# EAGLE board RectangularThing-SOICs-TWEAKS-3 (EAGLE 7.7.0), part 1 of 2
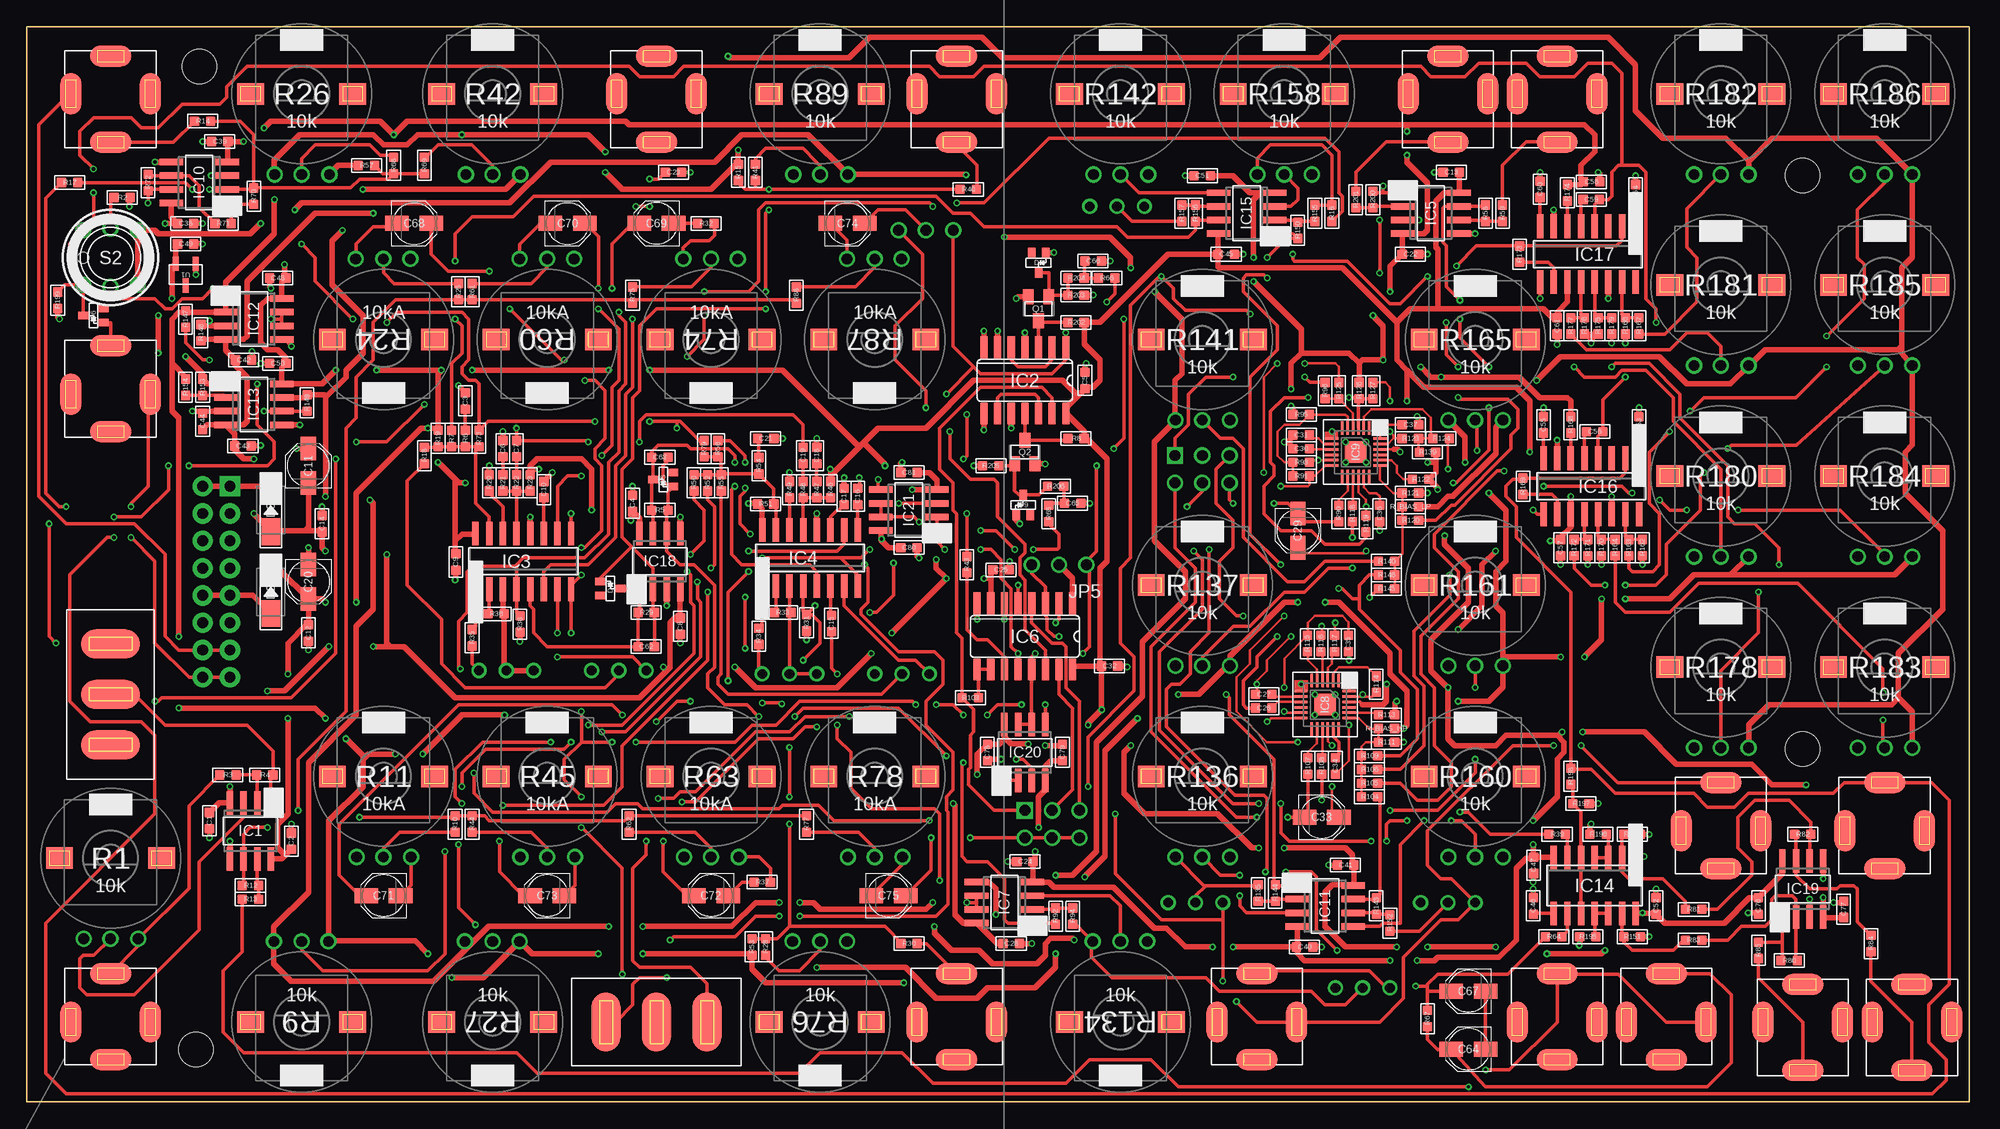
[diagram p13: board, top side]
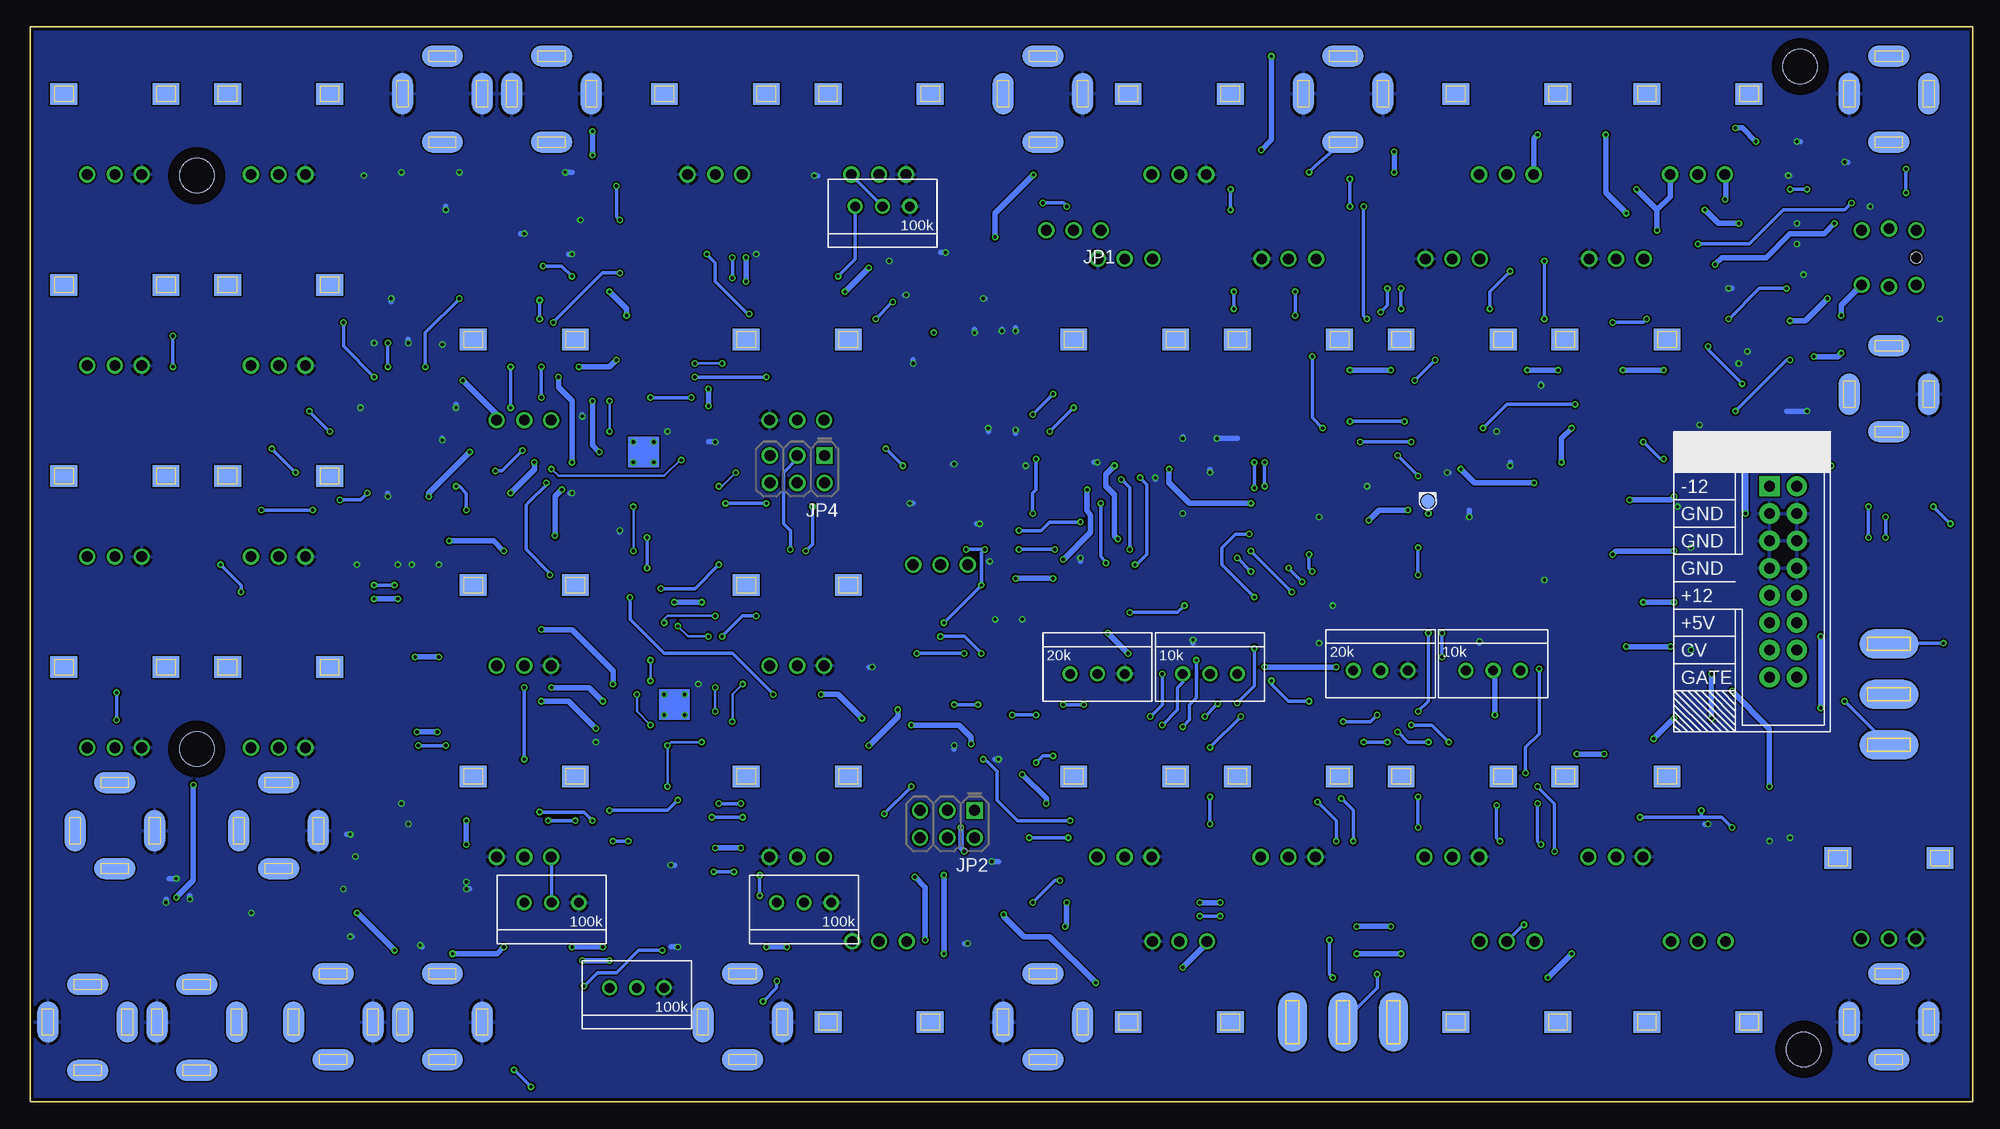
[diagram p14: board, bottom side, seen from below]

Size 180.78 x 100 mm. Coordinates in mm from the lower left corner, seen from the top.
Copper layers (1*16): Top 0.035mm / dielectric 1.5mm / Bottom 0.035mm
Design rules "ITEADstudio_DRC *": minimum track width 6mil, minimum drill 12mil, track to track 6mil, track to pad 6mil, pad to pad 6mil, via to via 6mil, smd to smd 0mil, copper to edge 10mil, drill to drill 10mil, minimum pad ring 10mil, minimum via ring 6mil, stop-mask expansion 2mil, vias tented up to drill 100mil, thermal gap 10mil
Net classes: 0 default: width 0.305 mm; 1 power: width 0.508 mm; 2 nearfilter: width 0.254 mm; 3 groundplane: width 0.203 mm, clearance 0.203 mm

## Footprints (pad centres in the part's own frame; a part is rotated, then mirrored left to right if it is on the bottom)
C0603 = smd 0.889 x 0.889: 1 -0.762,0; 2 0.762,0
CASE_B = smd 2.2 x 1.4: + 1.6,0; - -1.6,0
DO-214AC = smd 2.5 x 1.7: 1 -2,0; 2 2,0
SOT-323 = smd 0.7 x 0.9: ANODE -0.65,-0.95; CATHODE 0,0.95; NC 0.65,-0.95
3.2-NOMARKINGS-SMALLSAFEZONE = hole 3.2: 0,0
SO08 = smd 0.6 x 2.2: 1 -1.905,-2.6; 2 -0.635,-2.6; 3 0.635,-2.6; 4 1.905,-2.6; 5 1.905,2.6; 6 0.635,2.6; 7 -0.635,2.6; 8 -1.905,2.6
SO14 = smd 0.66 x 2.032: 1 -3.81,-3.073; 2 -2.54,-3.073; 3 -1.27,-3.073; 4 0,-3.073; 5 1.27,-3.073; 6 2.54,-3.073; 7 3.81,-3.073; 8 3.81,3.073; 9 2.54,3.073; 10 1.27,3.073; 11 0,3.073; 12 -1.27,3.073; 13 -2.54,3.073; 14 -3.81,3.073
SO16 = smd 0.6 x 2.2: 1 -4.445,-2.6; 2 -3.175,-2.6; 3 -1.905,-2.6; 4 -0.635,-2.6; 5 0.635,-2.6; 6 1.905,-2.6; 7 3.175,-2.6; 8 4.445,-2.6; 9 4.445,2.6; 10 3.175,2.6; 11 1.905,2.6; 12 0.635,2.6; 13 -0.635,2.6; 14 -1.905,2.6; 15 -3.175,2.6; 16 -4.445,2.6
SO16' = smd 0.66 x 2.032: 1 -4.445,-3.073; 2 -3.175,-3.073; 3 -1.905,-3.073; 4 -0.635,-3.073; 5 0.635,-3.073; 6 1.905,-3.073; 7 3.175,-3.073; 8 4.445,-3.073; 9 4.445,3.073; 10 3.175,3.073; 11 1.905,3.073; 12 0.635,3.073; 13 -0.635,3.073; 14 -1.905,3.073; 15 -3.175,3.073; 16 -4.445,3.073
QFN24 = smd 1.25 x 0.23: P$1 -2.25,1.25; P$2 -2.25,0.75; P$3 -2.25,0.25; P$4 -2.25,-0.25; P$5 -2.25,-0.75; P$6 -2.25,-1.25; P$13 2.25,-1.25; P$14 2.25,-0.75; P$15 2.25,-0.25; P$16 2.25,0.25; P$17 2.25,0.75; P$18 2.25,1.25 | smd 0.23 x 1.25: P$7 -1.25,-2.25; P$8 -0.75,-2.25; P$9 -0.25,-2.25; P$10 0.25,-2.25; P$11 0.75,-2.25; P$12 1.25,-2.25; P$19 1.25,2.25; P$20 0.75,2.25; P$21 0.25,2.25; P$22 -0.25,2.25; P$23 -0.75,2.25; P$24 -1.25,2.25 | smd 2 x 2: PAD 0,0
SO14' = smd 0.6 x 2.2: 1 -3.81,-2.6; 2 -2.54,-2.6; 3 -1.27,-2.6; 4 0,-2.6; 5 1.27,-2.6; 6 2.54,-2.6; 7 3.81,-2.6; 8 3.81,2.6; 9 2.54,2.6; 10 1.27,2.6; 11 0,2.6; 12 -1.27,2.6; 13 -2.54,2.6; 14 -3.81,2.6
3.5MM-JACK-SWITCH-13MM-NOHOLES = smd 1.95 x 3.85 bottom: RING_B@1 -3.7,0; SWITCH_B@1 3.7,0 | smd 1.95 x 3.85: RING_T@3 -3.7,0; SWITCH_T@3 3.7,0 | smd 3.85 x 1.95 bottom: SECOND_B@1 0,-3.5; TIP_B@1 0,4.5 | smd 3.85 x 1.95: SECOND_T@3 0,-3.5; TIP_T@3 0,4.5
POWER_16_SHROUDED = drill 1.016 pad 1.88 square: 1 -8.89,-1.27 | drill 1.016 pad 1.88: 2 -8.89,1.27; 3 -6.35,-1.27; 4 -6.35,1.27; 5 -3.81,-1.27; 6 -3.81,1.27; 7 -1.27,-1.27; 8 -1.27,1.27; 9 1.27,-1.27; 10 1.27,1.27; 11 3.81,-1.27; 12 3.81,1.27; 13 6.35,-1.27; 14 6.35,1.27; 15 8.89,-1.27; 16 8.89,1.27
1X03_NO_SILK = drill 1.016: 1 0,0; 2 2.54,0; 3 5.08,0
2X3-NS = drill 1.016 square: 1 -2.54,-1.27 | drill 1.016: 2 -2.54,1.27; 3 0,-1.27; 4 0,1.27; 5 2.54,-1.27; 6 2.54,1.27
SOT23-BEC = smd 1 x 1.4: B -0.95,-1.1; C 0,1.1; E 0.95,-1.1
ALPS_POT_SQUAREHOLES = drill 1: P$1 -2.5,-7.5; P$2 0,-7.5; P$3 2.58,-7.5 | smd 2.5 x 2: P$4 -4.75,0; P$5 4.75,0 | smd 2.5 x 2 bottom: P$6 -4.75,0; P$7 4.75,0
R0603 = smd 0.889 x 0.889: 1 -0.762,0; 2 0.762,0
TRIMPOT = drill 0.9: P$1 -2.54,0; P$2 0,0; P$3 2.54,0
MULTICOMP1MS-ONOFFON_NOHOLES = smd 2.7 x 5.5 bottom: 1_B -4.7,0; 2_B 0,0; 3_B 4.7,0 | smd 2.7 x 5.5: 1_T -4.7,0; 2_T 0,0; 3_T 4.7,0
PB6149L = drill 1: 1 2.54,2.54; 2 2.54,-2.54; 3 -2.54,2.54; 4 -2.54,-2.54; LEDNEG 0,-2.7; LEDPOS 0,2.7 | hole 1: 2.54,0
PAD.03X.05 = smd 1.27 x 1.27: P$1 0,0
SOT95P237X112-3N = smd 1.321 x 0.559: 1 -1.016,0.94; 2 -1.016,-0.94; 3 1.016,0

## Placement (x,y rotation side)
C1  100nF  [C0603]  17,26.15 270 top
C2  100nF  [C0603]  24.62,24.24 270 top
C3  10nF  [C0603]  40.81,65.2 270 top
C4  100nF  [C0603]  56.37,55.67 270 top
C5  100nF  [C0603]  98.47,67.1 90 top
C6  10nF  [C0603]  44.3,60.75 270 top
C7  100nF  [C0603]  45.57,60.75 90 top
C8  100nF  [C0603]  60.81,44.24 90 top
C9  100nF  [C0603]  39.92,50.21 90 top
C10  1nF C0G  [C0603]  48.11,56.94 90 top
C11  10u  [CASE_B]  26.2,59.17 90 top
C12  100nF  [C0603]  26.2,43.61 270 top
C13  100nF  [C0603]  132.57,86.47 0 top
C14  100nF  [C0603]  27.47,53.77 90 top
C15  1nF C0G  [C0603]  74.88,44.5 270 top
C16  1nF C0G  [C0603]  77.32,56.31 270 top
C17  1nF C0G  [C0603]  76.05,56.31 90 top
C18  10nF  [C0603]  73.51,60.12 270 top
C19  100nF  [C0603]  72.24,60.12 90 top
C20  10u  [CASE_B]  26.2,48.37 270 top
C21  10nF  [C0603]  68.75,61.71 180 top
C22  100nF  [C0603]  128.76,78.85 0 top
C23  1nF C0G  [C0603]  60.18,86.47 0 top
C24  100nF  [C0603]  92.88,22.34 180 top
C25  100nF  [C0603]  90.66,49.48 180 top
C26  300pF  [C0603]  115.1,36.62 0 top
C27  300pF  [C0603]  115.1,37.89 180 top
C28  100nF  [C0603]  91.61,14.72 180 top
C29  1uF  [CASE_B]  118.28,53.13 270 top
C30  300pF  [C0603]  118.6,60.75 0 top
C31  300pF  [C0603]  118.6,62.02 0 top
C32  100nF  [C0603]  100.75,40.53 0 top
C33  1uF  [CASE_B]  120.5,26.46 0 top
C34  300pF  [C0603]  121.77,31.23 270 top
C35  300pF  [C0603]  122.98,42.62 90 top
C36  300pF  [C0603]  125.9,54.72 270 top
C37  300pF  [C0603]  128.76,62.98 0 top
C38  100nF  [C0603]  14.77,81.71 180 top
C39  100nF  [C0603]  17.95,89.33 0 top
C40  100nF  [C0603]  118.91,14.4 0 top
C41  100nF  [C0603]  122.72,22.02 0 top
C42  100nF  [C0603]  20.17,69.01 0 top
C43  100nF  [C0603]  20.11,61.01 0 top
C44  100nF  [C0603]  16.36,63.29 90 top
C45  100nF  [C0603]  111.61,78.85 180 top
C46  5nF  [C0603]  140.19,18.21 90 top
C47  100nF  [C0603]  140.22,21.99 270 top
C48  100nF  [C0603]  23.35,76.63 0 top
C49  100nF  [C0603]  14.77,79.8 180 top
C50  100nF  [C0603]  23.35,68.69 0 top
C51  100nF  [C0603]  109.39,86.15 180 top
C52  100nF  [C0603]  151.62,18.21 270 top
C53  39nF  [C0603]  150.03,62.98 270 top
C54  39nF  [C0603]  149.71,84.57 270 top
C55  20nF  [C0603]  141.14,62.98 270 top
C56  10nF  [C0603]  145.9,62.34 180 top
C57  100nF  [C0603]  142.73,51.55 90 top
C58  100nF  [C0603]  145.61,85.58 180 top
C59  20nF  [C0603]  145.58,83.93 180 top
C60  20nF  [C0603]  140.82,84.88 270 top
C61  100nF  [C0603]  142.41,72.18 270 top
C62  10nF  [C0603]  57.64,42.34 0 top
C63  10nF  [C0603]  58.91,59.96 0 top
C64  10u  [CASE_B]  134.15,4.87 180 top
C65  33pF  [C0603]  97.32,55.67 180 top
C66  33pF  [C0603]  99.23,78.22 180 top
C67  10u  [CASE_B]  134.15,10.27 180 top
C68  10u  [CASE_B]  36.05,81.71 0 top
C69  10u  [CASE_B]  58.59,81.71 180 top
C70  10u  [CASE_B]  50.33,81.71 0 top
C71  10u  [CASE_B]  33.19,19.16 180 top
C72  10u  [CASE_B]  63.67,19.16 180 top
C73  10u  [CASE_B]  48.43,19.16 180 top
C74  10u  [CASE_B]  76.37,81.71 0 top
C75  10u  [CASE_B]  80.18,19.16 0 top
C76  100nF  [C0603]  161.14,18.21 90 top
C77  100nF  [C0603]  169.08,17.89 270 top
C78  100nF  [C0603]  89.39,32.5 90 top
C79  100nF  [C0603]  96.37,32.5 270 top
C80  100nF  [C0603]  82.08,51.55 180 top
C81  100nF  [C0603]  82.08,58.53 0 top
D2  1n4004  [DO-214AC]  22.71,47.42 90 top
D3  1n4004  [DO-214AC]  22.71,55.04 90 top
D4  BAS16W  [SOT-323]  54.3,47.74 270 top
D5  BAS16W  [SOT-323]  59.22,57.9 90 top
D6  BAS16W  [SOT-323]  6.2,73.14 90 top
D8  BAS16W  [SOT-323]  94.15,78.06 180 top
D9  BAS16W  [SOT-323]  92.72,55.52 0 top
H1  MOUNT-HOLE  [3.2-NOMARKINGS-SMALLSAFEZONE]  15.73,4.87 0 top
H2  MOUNT-HOLE  [3.2-NOMARKINGS-SMALLSAFEZONE]  16.04,96.31 0 top
H3  MOUNT-HOLE  [3.2-NOMARKINGS-SMALLSAFEZONE]  165.27,32.81 0 top
H4  MOUNT-HOLE  [3.2-NOMARKINGS-SMALLSAFEZONE]  165.27,86.15 0 top
IC1  TL072  [SO08]  20.81,25.19 180 top
IC2  4013D  [SO14]  92.88,67.1 180 top
IC3  CEM3340SOIC16  [SO16]  46.21,50.28 0 top
IC4  CEM3340SOIC16  [SO16]  72.88,50.59 0 top
IC5  TL072  [SO08]  130.66,82.66 270 top
IC6  4053D  [SO16']  92.88,43.29 180 top
IC7  TL072  [SO08]  90.97,18.53 90 top
IC8  CEM3320_UNFOLDEDQFN  [QFN24]  120.82,36.94 270 top
IC9  CEM3320QFN24  [QFN24]  123.68,60.44 270 top
IC10  TL072  [SO08]  16.04,85.52 90 top
IC11  TL072  [SO08]  120.82,18.21 270 top
IC12  TL072  [SO08]  21.12,72.82 270 top
IC13  TL072  [SO08]  21.12,64.88 270 top
IC14  CEM3360SOIC14  [SO14']  145.9,20.11 180 top
IC15  TL072  [SO08]  113.52,82.66 90 top
IC16  CEM3310SOIC16  [SO16]  145.58,57.26 180 top
IC17  CEM3310SOIC16  [SO16]  145.27,78.85 180 top
IC18  TL072  [SO08]  58.91,50.28 0 top
IC19  TL072  [SO08]  165.27,19.8 0 top
IC20  TL072  [SO08]  92.88,32.5 0 top
IC21  TL072  [SO08]  82.08,55.04 90 top
J1  PJ-341  [3.5MM-JACK-SWITCH-13MM-NOHOLES]  7.79,7.41 0 top
J2  PJ-341  [3.5MM-JACK-SWITCH-13MM-NOHOLES]  7.79,65.83 0 top
J3  PJ-341  [3.5MM-JACK-SWITCH-13MM-NOHOLES]  7.79,93.77 180 top
J4  PJ-341  [3.5MM-JACK-SWITCH-13MM-NOHOLES]  58.59,93.77 180 top
J5  PJ-341  [3.5MM-JACK-SWITCH-13MM-NOHOLES]  86.53,7.41 0 top
J6  PJ-341  [3.5MM-JACK-SWITCH-13MM-NOHOLES]  86.53,93.77 180 top
J7  PJ-341  [3.5MM-JACK-SWITCH-13MM-NOHOLES]  142.41,7.41 0 top
J8  PJ-341  [3.5MM-JACK-SWITCH-13MM-NOHOLES]  132.25,93.77 180 top
J9  PJ-341  [3.5MM-JACK-SWITCH-13MM-NOHOLES]  152.57,7.41 0 top
J10  PJ-341  [3.5MM-JACK-SWITCH-13MM-NOHOLES]  175.43,7.41 180 top
J11  PJ-341  [3.5MM-JACK-SWITCH-13MM-NOHOLES]  157.65,25.19 0 top
J12  PJ-341  [3.5MM-JACK-SWITCH-13MM-NOHOLES]  165.27,7.41 180 top
J13  PJ-341  [3.5MM-JACK-SWITCH-13MM-NOHOLES]  172.89,25.19 0 top
J14  POWERSHROUDED  [POWER_16_SHROUDED]  17.63,48.37 270 bottom
J15  PJ-341  [3.5MM-JACK-SWITCH-13MM-NOHOLES]  114.47,7.41 0 top
J16  PJ-341  [3.5MM-JACK-SWITCH-13MM-NOHOLES]  142.41,93.77 180 top
JP1  1x3pin header  [1X03_NO_SILK]  81.13,81.07 180 bottom
JP2  2x3pin header  [2X3-NS]  95.42,25.83 180 bottom
JP4  2x3pin header  [2X3-NS]  109.39,58.85 180 bottom
JP5  1x3pin header  [1X03_NO_SILK]  98.59,49.96 180 top
PCB1  EURORACK_PCB36HP_10CM  [EURORACK36HP]  -0.34,-3 0 top
Q1  MMBT3904  [SOT23-BEC]  94.15,73.77 180 top
Q2  MMBT3904  [SOT23-BEC]  92.88,60.44 0 top
R1  10k  [ALPS_POT_SQUAREHOLES]  7.79,22.65 0 top
R2  1k  [R0603]  8.87,84.12 0 top
R3  100k  [R0603]  18.71,30.4 0 top
R4  100k  [R0603]  22.14,30.4 0 top
R5  100k  [R0603]  58.91,55.04 0 top
R6  470  [R0603]  40.81,61.71 90 top
R7  100k  [R0603]  39.54,61.71 270 top
R8  68k  [R0603]  97.64,61.71 0 top
R9  10k  [ALPS_POT_SQUAREHOLES]  25.57,7.41 180 top
R10  100k  [R0603]  39.86,25.83 90 top
R11  10kA  [ALPS_POT_SQUAREHOLES]  33.19,30.27 0 top
R12  100k  [R0603]  20.81,20.11 0 top
R13  100  [R0603]  20.81,18.84 180 top
R14  100k  [R0603]  16.36,91.23 0 top
R15  100k  [R0603]  66.21,86.47 90 top
R16  100  [R0603]  121.45,82.66 90 top
R17  100k  [R0603]  3.98,85.52 0 top
R18  1M  [R0603]  37,60.12 270 top
R19  360k  [R0603]  38.27,61.71 270 top
R20  1.8k  [R0603]  43.03,57.58 270 top
R21  470  [R0603]  44.3,57.58 90 top
R22  1M  [R0603]  45.57,57.58 270 top
R23  1.5M  [R0603]  46.84,57.58 270 top
R24  10kA  [ALPS_POT_SQUAREHOLES]  33.19,70.91 180 top
R25  100k  [R0603]  40.17,75.36 270 top
R26  10k  [ALPS_POT_SQUAREHOLES]  25.57,93.77 0 top
R27  10k  [ALPS_POT_SQUAREHOLES]  43.35,7.41 180 top
R28  200k  [R0603]  68.75,14.4 270 top
R29  100k  [R0603]  57.64,45.51 180 top
R30  100k  [R0603]  82.08,14.72 180 top
R31  51k  [R0603]  72.56,44.56 270 top
R32  51k  [R0603]  63.19,81.71 0 top
R33  5.6k  [R0603]  70.34,45.51 0 top
R34  24k  [R0603]  68.11,43.29 270 top
R35  24k  [R0603]  41.44,43.16 270 top
R36  5.6k  [R0603]  43.67,45.39 0 top
R37  51k  [R0603]  68.43,20.43 0 top
R38  51k  [R0603]  45.89,44.43 270 top
R39  47k  [R0603]  142.41,24.88 0 top
R40  100k  [R0603]  87.61,84.88 180 top
R41  200k  [R0603]  67.8,86.47 90 top
R42  10k  [ALPS_POT_SQUAREHOLES]  43.35,93.77 0 top
R43  100k  [R0603]  87.48,49.96 90 top
R44  51k  [R0603]  41.44,25.83 90 top
R45  10kA  [ALPS_POT_SQUAREHOLES]  48.43,30.27 0 top
R46  1.5M  [R0603]  74.78,56.94 270 top
R47  470  [R0603]  73.51,56.94 90 top
R48  1M  [R0603]  72.24,56.94 270 top
R49  1.8k  [R0603]  70.97,56.94 270 top
R50  100k  [R0603]  62.08,57.58 90 top
R51  360k  [R0603]  68.75,55.61 0 top
R52  1M  [R0603]  63.35,57.58 90 top
R53  100k  [R0603]  67.48,14.4 90 top
R54  470  [R0603]  68.11,59.17 90 top
R55  1M  [R0603]  64.62,57.58 270 top
R56  100k  [R0603]  64.3,60.75 270 top
R57  100k  [R0603]  31.6,87.11 0 top
R58  100k  [R0603]  135.74,82.66 90 top
R59  100k  [R0603]  137.33,82.66 270 top
R60  10kA  [ALPS_POT_SQUAREHOLES]  48.43,70.91 180 top
R61  51k  [R0603]  41.44,75.36 270 top
R62  10k  [R0603]  56.05,25.83 90 top
R63  10kA  [ALPS_POT_SQUAREHOLES]  63.67,30.27 0 top
R64  47k  [R0603]  142.09,15.35 180 top
R65  10k  [R0603]  95.1,54.72 270 top
R66  10k  [R0603]  100.5,76.63 0 top
R67  0  [R0603]  130.34,7.73 90 top
R68  1M  [R0603]  34.14,87.11 270 top
R69  100k  [R0603]  37,87.11 270 top
R70  100k  [R0603]  21.12,84.25 270 top
R71  100k  [R0603]  18.27,81.71 180 top
R72  100k  [R0603]  11.28,85.52 270 top
R73  100k 0.1%  [R0603]  42.08,61.71 270 top
R74  10kA  [ALPS_POT_SQUAREHOLES]  63.67,70.91 180 top
R75  10k  [R0603]  56.37,75.04 270 top
R76  10k  [ALPS_POT_SQUAREHOLES]  73.83,7.41 180 top
R77  100k  [R0603]  72.56,25.83 90 top
R78  10kA  [ALPS_POT_SQUAREHOLES]  78.91,30.27 0 top
R79  100k 0.1%  [R0603]  63.03,60.75 270 top
R80  100k  [R0603]  164,13.13 180 top
R81  100k  [R0603]  155.11,17.89 0 top
R82  100k  [R0603]  165.27,24.88 180 top
R83  100k  [R0603]  155.11,15.03 0 top
R84  100  [R0603]  171.62,14.72 270 top
R85  100  [R0603]  161.14,14.08 270 top
R87  10kA  [ALPS_POT_SQUAREHOLES]  78.91,70.91 180 top
R88  100k  [R0603]  71.61,75.04 270 top
R89  10k  [ALPS_POT_SQUAREHOLES]  73.83,93.77 0 top
R90  51.1k  [R0603]  122.09,54.72 90 top
R91  91k  [R0603]  118.6,58.21 0 top
R92  100k  [R0603]  95.74,17.26 270 top
R93  100k  [R0603]  118.6,59.48 0 top
R94  100k  [R0603]  97.32,17.26 90 top
R95  220k  [R0603]  118.6,63.93 0 top
R96  91k  [R0603]  120.82,66.15 90 top
R103  100k  [R0603]  87.8,37.58 180 top
R104  51.1k  [R0603]  124.95,28.37 180 top
R105  100k  [R0603]  124.95,29.64 180 top
R106  100k  [R0603]  124.95,30.91 180 top
R107  51.1k  [R0603]  119.23,31.23 90 top
R108  100k  [R0603]  120.5,31.23 270 top
R109  100k  [R0603]  124.95,32.18 180 top
R111  1.8k  [R0603]  126.53,33.45 0 top
R113  1.8k  [R0603]  126.53,35.99 0 top
R114  100k  [R0603]  125.58,38.85 270 top
R115  100k  [R0603]  119.17,42.62 90 top
R116  100k  [R0603]  120.44,42.62 90 top
R117  100k  [R0603]  121.71,42.62 90 top
R118  100k  [R0603]  123.36,54.72 270 top
R119  100k  [R0603]  124.63,53.77 270 top
R120  100k  [R0603]  128.76,54.09 180 top
R121  1.8k  [R0603]  128.76,56.63 0 top
R122  1.8k  [R0603]  129.71,57.9 180 top
R123  100k  [R0603]  128.76,61.71 0 top
R124  91k  [R0603]  131.61,61.71 180 top
R125  100k  [R0603]  122.09,66.15 90 top
R126  220k  [R0603]  123.99,66.15 90 top
R127  91k  [R0603]  125.26,66.15 270 top
R134  10k  [ALPS_POT_SQUAREHOLES]  101.77,7.41 180 top
R135  100k  [R0603]  114.6,19.42 270 top
R136  10k  [ALPS_POT_SQUAREHOLES]  109.39,30.27 0 top
R137  10k  [ALPS_POT_SQUAREHOLES]  109.39,48.05 0 top
R139  220k  [R0603]  130.34,60.44 0 top
R140  100k  [R0603]  126.53,50.28 0 top
R141  10k  [ALPS_POT_SQUAREHOLES]  109.39,70.91 0 top
R142  10k  [ALPS_POT_SQUAREHOLES]  101.77,93.77 0 top
R143  100k  [R0603]  125.58,18.21 90 top
R144  100k  [R0603]  116.18,19.42 90 top
R145  51.1k  [R0603]  126.53,47.74 0 top
R146  100k  [R0603]  126.53,49.01 0 top
R147  100k  [R0603]  14.77,72.82 270 top
R148  10k  [R0603]  16.2,71.55 90 top
R149  100k  [R0603]  26.08,65.01 90 top
R150  100k  [R0603]  118.28,81.07 270 top
R151  47k  [R0603]  149.39,15.35 0 top
R152  100k  [R0603]  126.85,16.62 90 top
R153  200k  [R0603]  16.36,66.47 90 top
R154  100k  [R0603]  14.77,66.47 270 top
R155  100k  [R0603]  119.87,82.66 270 top
R156  100k  [R0603]  108.75,82.66 270 top
R157  100k  [R0603]  107.48,82.66 90 top
R158  10k  [ALPS_POT_SQUAREHOLES]  117.01,93.77 0 top
R159  47k  [R0603]  149.39,24.88 0 top
R160  10k  [ALPS_POT_SQUAREHOLES]  134.79,30.27 0 top
R161  10k  [ALPS_POT_SQUAREHOLES]  134.79,48.05 0 top
R162  470  [R0603]  150.35,51.55 270 top
R163  10k  [R0603]  149.08,51.55 270 top
R164  10k  [R0603]  147.81,51.55 270 top
R165  10k  [ALPS_POT_SQUAREHOLES]  134.79,70.91 0 top
R166  470  [R0603]  148.76,72.18 270 top
R167  10k  [R0603]  150.03,72.18 270 top
R168  470  [R0603]  143.68,62.98 90 top
R169  24k  [R0603]  139.23,57.26 90 top
R170  470  [R0603]  146.54,51.55 270 top
R171  470  [R0603]  145.27,51.55 90 top
R172  10k  [R0603]  144,51.55 270 top
R173  24k  [R0603]  138.92,78.85 90 top
R174  470  [R0603]  143.36,84.57 90 top
R175  470  [R0603]  146.22,72.18 270 top
R176  470  [R0603]  144.95,72.18 90 top
R177  10k  [R0603]  143.68,72.18 270 top
R178  10k  [ALPS_POT_SQUAREHOLES]  157.65,40.43 0 top
R179  10k  [R0603]  147.49,72.18 270 top
R180  10k  [ALPS_POT_SQUAREHOLES]  157.65,58.21 0 top
R181  10k  [ALPS_POT_SQUAREHOLES]  157.65,75.99 0 top
R182  10k  [ALPS_POT_SQUAREHOLES]  157.65,93.77 0 top
R183  10k  [ALPS_POT_SQUAREHOLES]  172.89,40.43 0 top
R184  10k  [ALPS_POT_SQUAREHOLES]  172.89,58.21 0 top
R185  10k  [ALPS_POT_SQUAREHOLES]  172.89,75.99 0 top
R186  10k  [ALPS_POT_SQUAREHOLES]  172.89,93.77 0 top
R187  10k  [TRIMPOT]  70.97,39.8 0 bottom
R188  20k  [TRIMPOT]  55.1,40.12 0 bottom
R189  20k  [TRIMPOT]  81.45,39.8 0 bottom
R190  10k  [TRIMPOT]  44.62,40.12 0 bottom
R191  100k  [TRIMPOT]  124.31,10.59 180 bottom
R192  100k  [TRIMPOT]  108.75,18.53 180 bottom
R193  100k  [TRIMPOT]  101.45,83.3 180 bottom
R194  100k  [TRIMPOT]  132.25,18.53 180 bottom
R195  4M7  [R0603]  145.27,15.35 180 top
R196  4M7  [R0603]  146.22,24.88 0 top
R197  10k  [R0603]  144.63,27.73 0 top
R198  15k  [R0603]  143.68,30.27 270 top
R199  100k  [R0603]  2.87,74.57 270 top
R200  100k  [R0603]  125.26,83.93 90 top
R201  100k  [R0603]  123.68,83.93 270 top
R202  68k  [R0603]  97.64,72.5 0 top
R203  33k  [R0603]  97.64,75.04 180 top
R204  220k  [R0603]  97.64,76.63 0 top
R205  33k  [R0603]  89.7,59.17 0 top
R206  220k  [R0603]  95.74,57.26 0 top
R_BIAS_HP  100k  [R0603]  126.53,34.72 0 top
R_BIAS_LP  BIAS DNP  [R0603]  128.76,55.36 180 top
S1  ONOFFONNOHOLES  [MULTICOMP1MS-ONOFFON_NOHOLES]  7.79,37.89 90 top
S2  SWITCH_W_LED_PB6149L-X-102YELLOW  [PB6149L]  7.79,78.53 180 top
S3  ONOFFONNOHOLES  [MULTICOMP1MS-ONOFFON_NOHOLES]  58.59,7.41 0 top
TP3  TEST-POINT3X5  [PAD.03X.05]  50.7,55.87 0 bottom
U1  LM4040DIM3-5.0  [SOT95P237X112-3N]  14.77,76.95 270 top

## Tracks (layer width: path | path; a pad name or v marks a point on that pad's centre or on a via)
5V  (via drill 0.3)
  Top 0.508: IC13.7 25.82,65.52 R149.2 27.66,65.77 27.79,65.64 | 41.57,14.91 37.88,11.22 24.62,11.22 22.99,12.85 R9.P$3 22.99,16.26 26.2,19.48 26.2,31.54 30.65,35.99 30.65,44.24 32.24,45.83 32.24,55.67 v31.92,55.99 | v31.28,84.88 44.54,84.88 R42.P$3 | 137.37,41.35 137.37,45.47 136.69,46.15 136.69,49.32 137.65,50.28 137.65,55.04 v136.06,56.63 | v146.54,46.78 146.54,42.97 v144.95,41.39 | v142.73,41.39 137.4,41.39 137.37,41.35 | v133.2,37.26 136.06,37.26 137.37,38.57 R161.P$3 137.37,41.35 | R_BIAS_HP.2 v128.12,34.72 128.44,35.04 128.44,38.21 126.85,39.8 126.85,41.7 122.09,46.47 v120.82,46.47 | v27.79,56.31 27.79,65.64 | 27.79,65.64 27.92,65.64 29.7,67.42 29.7,68.06 31.28,69.64 31.28,73.14 28.43,75.99 28.43,80.12 v29.38,81.07 | v54.14,16.3 42.96,16.3 41.57,14.91 | v103.36,35.67 100.34,32.66 100.34,22.81 v98.43,20.91 | v107.17,37.89 109.07,37.89 111.97,40.79 | 111.97,40.79 111.97,41.43 117.01,46.47 v118.28,46.47 | v57.32,16.3 65.57,16.3 67.8,18.53 v70.02,18.53 | v148.76,46.78 152.89,46.78 155.11,49.01 158.52,49.01 | 158.52,49.01 R180.P$3 | R184.P$3 175.47,50.63 173.84,49.01 158.52,49.01 | 111.97,40.79 R137.P$3 | v133.84,59.48 133.84,61.87 R165.P$1 | R27.P$3 41.57,14.91 | R57.1 28.98,87.11 R26.P$3 | v71.92,18.53 73.19,18.53 73.83,17.89 83.67,17.89 v84.31,18.53 | v84.46,16.3 84.46,15.67 86.05,14.08 88.59,14.08 89.86,12.81 93.99,12.81 94.78,13.6 94.78,14.72 95.26,15.19 97.32,15.19 v97.48,15.03
  Bottom 0.508: v136.06,56.63 133.84,58.85 v133.84,59.48 | v148.76,46.78 v146.54,46.78 | v144.95,41.39 v142.73,41.39 | v133.2,37.26 130.66,37.26 v128.12,34.72 | v31.92,55.99 28.11,55.99 v27.79,56.31 | v29.38,81.07 29.38,82.98 | 29.38,82.98 v31.28,84.88 | v54.14,16.3 v57.32,16.3 | v70.02,18.53 v71.92,18.53 | v103.36,35.67 105.58,37.89 v107.17,37.89 | v118.28,46.47 v120.82,46.47 | R26.P$3 28.15,84.21 29.38,82.98 | v84.31,18.53 84.31,16.46 v84.46,16.3 | v97.48,15.03 97.48,19.96 v98.43,20.91
10V  (via drill 0.3)
  Top 0.508: IC13.1 16.8,66.79 R153.2 16.36,67.74 v14.77,69.33 | S2.3 S2.4 11.92,81.07 12.23,80.76 20.8,80.76 v21.76,81.71 | v12.23,69.64 v12.23,73.14 | v104.94,75.36 107.48,72.82 107.48,67.74 106.85,67.1 106.85,63.45 R141.P$1 106.89,63.33 104.94,61.39 104.94,52.18 107.8,49.32 107.8,46.78 103.83,42.81 103.83,37.73 99.55,33.45 99.55,23.29 97.32,21.07 v95.73,21.07 | v102.72,77.58 102.72,78.53 100.82,80.44 v90.97,80.44 | v24.93,82.98 25.57,83.61 44.94,83.61 48.75,87.42 63.99,87.42 66.53,89.96 72.72,89.96 R89.P$3 87.36,86.27 v87.4,86.23 | v73.51,12.49 81.77,12.49 84.62,9.64 88.43,9.64 89.39,10.59 93.83,10.59 95.73,12.49 v95.73,13.76
  Bottom 0.508: v14.77,69.33 12.55,69.33 v12.23,69.64 | v12.23,73.14 12.23,74.09 S2.3 | v104.94,75.36 v102.72,77.58 | v21.76,81.71 23.66,81.71 v24.93,82.98 | v87.4,86.23 90.97,82.66 v90.97,80.44 | R76.P$3 71.25,14.76 v73.51,12.49 | v95.73,21.07 v95.73,13.76
12V  (via drill 0.3)
  Top 0.203: IC8.P$22 124.06,37.19
  Top 0.229: IC9.P$22 127.23,60.69
  Top 0.33: 124.06,37.19 124.31,36.94
  Top 0.508: IC17.11 143.36,74.41 142.41,73.45 C61.1 141.96,72.95 141.14,73.77 131.14,73.77 | C45.2 110.85,80.69 IC15.8 | IC4.16 68.43,55.17 R51.1 67.92,55.67 v67.16,55.67 | IC18.8 57,54.28 C4.2 v56.21,54.09 | 39.86,52.18 40.49,52.82 41.7,52.82 IC3.16 | 39.86,52.18 39.86,51.04 C9.2 | IC1.8 23.73,22.59 24.04,22.91 | 24.04,22.91 C2.2 | 124.31,36.94 126.22,36.94 126.53,37.26 v126.53,38.85 | 97.8,65.68 96.69,64.56 IC2.14 98.4,62.32 R8.2 98.59,61.71 100.5,59.8 100.5,50.28 99.86,49.64 99.86,40.66 C32.1 | 97.8,65.68 C5.1 98.59,66.47 99.23,66.47 99.86,67.1 99.86,69.01 98.4,70.47 R202.2 99.86,72.5 106.21,78.85 C45.2 | C32.1 97.63,40.53 IC6.16 | 127.23,60.69 127.55,60.69 v127.8,60.44 | 131.14,73.77 128.76,73.77 127.48,72.5 | 127.48,72.5 127.48,69.01 128.44,68.06 | 128.44,68.06 v128.44,65.2 | C45.2 110.85,77.71 110.98,77.58 122.41,77.58 127.48,72.5 | v143.68,56.31 IC16.11 143.68,53.45 142.73,52.5 C57.2 142.6,52.18 v141.77,52.18 | v139.87,60.44 139.87,65.2 138.6,66.47 130.03,66.47 128.44,68.06 | 77.32,60.75 74.78,58.21 R46.1 v74.78,58.85 | 77.32,60.75 77.88,61.31 | 77.88,61.31 79.23,62.66 83.67,62.66 88.12,67.1 96.37,67.1 97.8,65.68 | 77.32,60.75 77.32,61.07 70.34,68.06 v57.95,68.06 | v54.14,68.06 v41.44,68.06 | R23.1 46.84,58.85 | 46.84,58.85 46.84,59.17 47.48,59.8 51.6,59.8 52.56,58.85 v52.56,55.04 | 39.86,52.18 39.86,57.9 | 39.86,57.9 v38.27,59.48 | v30.65,46.47 30.65,56.63 36.68,62.66 v37.32,62.66 38.08,62.66 R19.1 38.27,67.74 v38.59,68.06 v32.55,68.06 | v28.74,68.06 27.47,66.79 IC13.8 23.72,68.31 C50.2 24.11,69.2 23.34,69.96 22.39,69.96 21.76,70.6 21.76,74.09 22.39,74.72 IC12.8 23.72,76.24 C48.2 23.98,76.76 v23.98,77.9
  Top 0.508: v150.35,17.57 150.29,17.51 IC14.14 151.55,17.51 C52.2 152.44,16.62 157.97,16.62 160.31,18.97 C76.2 163.36,21.19 IC19.8 | v146.85,14.08 146.54,13.76 v141.46,13.76 | v136.69,14.4 v130.34,14.4 | IC10.8 13.44,82.28 C38.2 v12.87,81.71 | v133.2,43.93 135.42,46.15 135.42,49.96 v136.69,51.23 | v24.3,35.67 24.3,26.78 23.34,25.83 23.34,23.61 24.04,22.91 | 39.86,57.9 40.17,57.58 v40.81,57.58 | v47.63,58.85 46.84,58.85 | v102.72,33.13 102.09,32.5 102.09,28.69 103.99,26.78 110.82,26.78 113.99,23.61 v114.63,23.61 | D2.2 23.55,49.42 C20.+ | C20.+ 27.48,46.77 v27.79,46.47 | C20.+ C12.1 26.01,44.37 24.3,42.66 v24.3,39.8 | C13.2 133.33,84.63 IC5.8 131.93,84.57 131.14,83.77 131.14,79.49 131.3,79.33 131.3,73.93 131.14,73.77 | 90.91,14.78 C28.2 90.34,14.72 88.43,16.62 IC7.8 87.16,16.62 86.37,17.42 86.37,27.58 v86.21,27.73 | IC11.8 123.48,20.18 | 123.48,20.18 C41.2 123.36,22.15 123.36,22.97 122.72,23.61 v117.01,23.61 | C80.2 80.18,51.55 79.48,52.24 IC21.8 79.48,52.4 v79.54,52.34 | 123.48,20.18 121.52,20.18 120.82,19.48 120.82,16.3 122.72,14.4 v127.48,14.4 | v79.86,59.17 79.86,59.32 77.88,61.31 | C32.1 99.99,36.5 v100.02,36.46 98.75,35.2 v98.75,35.04 | v88.43,30.43 88.43,32.31 C78.2 90.47,33.26 90.97,33.77 IC20.8 90.97,33.92 91.61,33.29 v93.2,33.29
  Bottom 0.508: v127.8,60.44 128.44,61.07 v128.44,65.2 | v143.68,56.31 143.68,56.63 v139.87,60.44 | v74.78,58.85 74.78,57.58 72.88,55.67 v67.16,55.67 | v57.95,68.06 v54.14,68.06 | v41.44,68.06 v38.59,68.06 | v52.56,55.04 55.25,55.04 v56.21,54.09 | v38.27,59.48 38.27,61.71 v37.32,62.66 | v27.79,46.47 v30.65,46.47 | v28.74,68.06 v32.55,68.06 | v150.35,17.57 v146.85,14.08 | v141.46,13.76 137.33,13.76 v136.69,14.4 | v12.87,81.71 13.82,80.76 17,80.76 19.22,78.53 23.34,78.53 v23.98,77.9 | v126.53,38.85 126.53,40.12 130.34,43.93 v133.2,43.93 | v136.69,51.23 137.65,52.18 v141.77,52.18 | v24.3,39.8 v24.3,35.67 | v40.81,57.58 46.36,57.58 v47.63,58.85 | v102.72,33.13 100.02,35.83 v100.02,36.46 | v117.01,23.61 v114.63,23.61 | v127.48,14.4 v130.34,14.4 | v79.54,52.34 79.86,52.66 79.86,56.47 80.65,57.26 80.65,58.37 v79.86,59.17 | v86.21,27.73 86.21,28.21 v88.43,30.43 | v93.2,33.29 93.2,33.92 94.31,35.04 v98.75,35.04
-5_TO_10V
  Top 0.305: R154.2 R153.1 18.33,65.71 IC13.2
-5V  (via drill 0.3)
  Top 0.508: R154.1 14.77,67.42 13.5,68.69 | 13.5,68.69 13.5,72.82 14.14,73.45 14.65,73.45 R147.1 14.9,73.45 IC12.2 IC12.1 18.52,76.25 23.03,80.76 v23.03,83.93 | v140.5,67.1 142.73,69.33 151.93,69.33 154.47,66.79 158.52,66.79 R181.P$3 160.31,68.49 161.78,69.96 174.16,69.96 174.48,70.28 | 13.5,68.69 13.5,64.25 14.14,63.61 v14.14,43.29 | v14.14,36.62 26.84,36.62 v27.79,35.67 | v29.7,33.77 31.28,32.18 31.28,31.86 | 31.28,31.86 31.28,29.32 28.11,26.15 28.11,14.95 | R_BIAS_LP.1 131.3,55.36 132.25,56.31 132.72,56.31 136.69,60.28 136.69,62.74 R165.P$3 | v57.32,13.76 67.16,13.76 67.29,13.64 R53.1 67.48,12.33 68.75,11.06 v81.61,11.06 | R182.P$3 160.23,87.46 | v53.82,88.38 52.24,89.96 v40.49,89.96 36.36,89.96 35.41,89.01 33.19,89.01 32.24,89.96 25.41,89.96 23.03,87.58 23.03,86.31 R26.P$1 | v53.82,86.47 55.41,84.88 63.67,84.88 66.02,87.23 R15.2 v66.21,88.54 | 174.16,37.57 174.16,41.7 178.29,45.83 178.29,53.13 174.79,56.63 174.79,60.44 175.47,61.11 R185.P$3 174.48,69.65 174.48,70.28 | 174.48,70.28 174.48,77.58 175.47,78.57 R186.P$3 172.1,89.65 162.41,89.65 160.23,87.46 | R178.P$3 160.23,35.08 162.09,36.94 173.53,36.94 174.16,37.57 | R183.P$3 175.47,36.26 174.16,37.57 | 28.11,14.95 R9.P$1 | 28.11,14.95 36.13,14.95 v37.32,13.76 | v39.54,11.54 42.48,11.54 R27.P$1 47,13.76 v53.19,13.76 | 160.23,87.46 160.23,87.54 158.12,89.65 152.25,89.65 149.71,92.19 149.71,96.47 147.17,99.01 122.25,99.01 120.34,97.11 90.81,97.11 88.91,99.01 78.43,99.01 76.53,97.11 65.41,97.11 v65.26,97.27 | R190.P$1 R190.P$2 44.43,40.12 R36.2 44.3,45.51 IC3.3 | v44.46,35.99 40.49,35.99 v36.84,32.34
  Top 0.508: v34.3,32.34 31.76,32.34 31.28,31.86 | IC7.5 89.54,20.43 90.18,19.8 v90.18,17.42
  Bottom 0.508: v37.32,13.76 v39.54,11.54 | v14.14,43.29 v14.14,36.62 | v27.79,35.67 v29.7,33.77 | v57.32,13.76 v53.19,13.76 | 40.77,89.69 v40.49,89.96 40.85,89.61 R42.P$1 | v53.82,88.38 v53.82,86.47 | v23.03,83.93 22.99,83.97 22.99,86.19 R26.P$1 | R165.P$3 137.37,63.97 v140.5,67.1 | v65.26,97.27 65.26,89.49 v66.21,88.54 | R190.P$2 44.46,40.12 v44.46,35.99 | v36.84,32.34 v34.3,32.34 | v90.18,17.42 90.18,17.26 88.27,15.35 85.89,15.35 v81.61,11.06
-5V_OSC2  (via drill 0.3)
  Top 0.305: IC4.3 70.97,45.64 R33.2 70.97,45.51 R187.P$2 R187.P$1 | IC7.7 88.37,18.53 | 88.37,18.53 IC7.6 | v75.42,35.04 75.42,33.77 76.69,32.5 76.69,29.16 78.59,27.26 84.46,27.26 84.94,26.78 v84.94,20.59 | v87.48,18.53 88.37,18.53
  Bottom 0.305: R187.P$1 73.51,39 73.99,38.53 73.99,36.46 v75.42,35.04 | v84.94,20.59 85.42,20.59 v87.48,18.53
-5V_TO_5V  (via drill 0.3)
  Top 0.305: R149.1 IC13.6 v22.07,64.25 | v17,69.01 16.36,69.01 14.77,70.6 R147.2
  Bottom 0.305: v22.07,64.25 17.31,69.01 v17,69.01
-5VIN  (via drill 0.3)
  Top 0.508: IC12.3 17,72.18 | 17,72.18 16.49,72.18 16.36,72.31 R148.2 | C49.2 13.83,79.63 U1.2 13.5,77.63 v13.5,74.72 | v17,72.66 17,72.18
  Bottom 0.508: v13.5,74.72 15.57,72.66 v17,72.66
-12V  (via drill 0.3)
  Top 0.508: IC12.4 18.52,69.9 C42.1 19.41,68.5 20.49,67.42 20.49,63.29 20.17,62.98 IC13.4 | IC12.4 16.49,70.91 R148.1 | IC13.4 19.34,62.15 C43.1 19.22,60.82 20.17,59.8 v21.12,59.8 | IC13.4 16.8,62.98 C44.1 | 27.44,53.04 27.35,53.13 25.89,53.13 | IC18.4 C8.2 | C47.1 142.06,22.75 IC14.7 | C1.1 17.88,27.79 IC1.4 v18.9,29.32 | IC10.4 18.71,87.49 C39.2 v20.17,89.33 | IC6.7 89.7,48.69 | 89.7,48.69 89.7,49.07 C25.2 | R139.2 131.11,59.48 | 131.11,59.48 131.11,58.53 R122.1 131.3,57.07 v131.3,56.94 | C47.1 140.12,22.65 139.55,22.65 138.6,21.7 138.6,15.03 137.01,13.45 131.3,13.45 130.98,13.13 v129.39,13.13 | R174.2 144.6,85.33 C58.2 144.63,85.81 144.63,87.11 145.9,88.38 145.9,89.96 144.95,90.92 128.44,90.92 | v22.07,90.6 22.71,91.23 32.87,91.23 v34.14,89.96 35.41,91.23 55.73,91.23 56.05,90.92 128.44,90.92 | R95.1 117.83,64.53 v117.64,64.72 | v117.64,66.31 117.64,68.69 118.6,69.64 | 118.6,69.64 123.04,69.64 123.99,68.69 | 123.99,68.69 R126.2 | R168.2 143.68,65.2 143.36,65.52 140.82,65.52 138.92,67.42 v131.61,67.42 130.66,67.42 v129.71,68.37 | 123.99,68.69 124.31,69.01 v126.22,69.01 126.22,72.18 v125.26,73.14 | 118.6,69.64 118.6,71.87 v114.15,76.31 | v114.15,78.53 114.15,83.93 114.79,84.57 IC15.4 113.83,84.57 112.25,86.15 C51.1 | R113.2 127.3,37.07 v127.48,37.26 | 142.41,34.08 137.65,34.08 136.69,33.13 132.88,33.13 132.25,33.77 v132.25,38.53 130.66,40.12 130.66,42.97 134.15,46.47 134.15,49.64 131.93,51.86 v131.93,52.66 | 142.41,34.08 143.04,33.45 143.04,32.5 142.41,31.86 142.41,28.37 v140.19,26.15 | v140.19,23.92 140.19,22.78 C47.1 | D3.1 22.71,53.13 | 22.71,53.13 v21.12,54.72 | IC12.4 20.17,70.91 20.49,71.23 20.49,76.31 26.84,82.66 v32.24,82.66
  Top 0.508: v22.39,38.21 23.98,38.21 v28.11,42.34 | v32.24,42.34 33.82,42.34 | 33.82,42.34 35.09,42.34 39.86,37.58 57,37.58 59.54,40.12 | 60.94,44.88 C8.2 | v78.59,41.7 75.42,38.53 67.8,38.53 v65.89,40.43 | v80.5,43.61 v85.58,48.69 84.62,49.64 v84.62,50.43 | v89.07,48.69 89.7,48.69 | C14.1 27.47,52.82 | 27.47,52.82 27.47,51.55 v27.79,51.23 | v33.51,50.91 33.51,42.66 33.82,42.34 | C8.2 60.3,45.01 59.86,44.56 59.86,40.43 59.54,40.12 | v59.22,40.43 59.54,40.12 | 27.44,53.04 27.44,52.85 27.47,52.82 | C14.1 27.47,53.13 | 22.71,53.13 25.89,53.13 | 27.44,53.04 C14.1 | C11.- 26.2,53.45 25.89,53.13 | v130.34,59.48 131.11,59.48 | v126.85,75.36 126.85,77.71 C22.1 127.99,80.69 IC5.4 130.03,80.76 130.34,81.07 130.34,85.52 128.44,87.42 v128.44,88.06 | C79.2 95.29,31.73 94.78,31.23 IC20.4 94.78,29 94.15,28.37 v94.15,25.51 | C77.2 167.24,17.13 IC19.4 v167.17,19 | 118.22,14.47 C40.1 v112.25,14.4 | 118.22,14.47 IC11.4 | 118.22,14.47 118.22,13.82 118.91,13.13 v126.85,13.13 | C81.2 83.99,58.53 84.68,57.84 IC21.4 v82.4,56.94 | 128.44,90.92 v128.44,90.28 | v93.83,23.29 93.83,22.53 C24.1 93.64,20.5 IC7.4 95.1,20.43 95.58,19.96 101.13,19.96 104.94,16.14 106.05,16.14 107.8,14.4 v110.34,14.4 | 142.41,34.08 142.57,34.08 v142.88,34.4 | v144.79,34.4 150.5,34.4 153.52,31.39 160.51,31.39 162.41,29.48 v165.59,29.48
  Bottom 0.508: v22.07,90.6 21.44,90.6 v20.17,89.33 | v117.64,64.72 v117.64,66.31 | v129.71,68.37 126.85,68.37 v126.22,69.01 | v114.15,76.31 v114.15,78.53 | v127.48,37.26 128.76,38.53 v132.25,38.53 | v140.19,26.15 v140.19,23.92 | v21.12,54.72 v21.12,59.8 | v18.9,29.32 18.9,34.72 v22.39,38.21 | v28.11,42.34 v32.24,42.34 | v78.59,41.7 v80.5,43.61 | v85.58,48.69 v89.07,48.69 | v130.34,59.48 130.34,65.2 131.61,66.47 v131.61,67.42 | v27.79,51.23 33.19,51.23 v33.51,50.91 | v131.3,56.94 131.93,56.31 v131.93,52.66 | v65.89,40.43 v59.22,40.43 | v32.24,82.66 34.14,84.57 v34.14,89.96 | v125.26,73.14 125.26,73.77 v126.85,75.36 | v126.85,13.13 v129.39,13.13 | v128.44,90.28 v128.44,88.06 | v94.15,25.51 94.15,23.61 v93.83,23.29 | v82.4,56.94 82.4,55.04 82.08,54.56 82.08,52.97 v84.62,50.43 | v142.88,34.4 v144.79,34.4 | v165.59,29.48 165.59,20.59 v167.17,19 | v112.25,14.4 v110.34,14.4
A2_IN
  Top 0.305: R167.2 152.44,71.42 155.43,74.41 155.43,78.53 154.47,79.49 154.47,83.1 R182.P$2
A_IN  (via drill 0.3)
  Top 0.305: R163.2 149.08,49.64 149.39,49.32 151.3,49.32 151.93,49.96 151.93,54.72 150.98,55.67 150.98,60.44 v152.89,62.34 | v154.79,64.25 156.06,65.52 164.63,65.52 v167.49,68.37 | R186.P$2 172.89,85.52 170.35,82.98 170.35,78.53 170.98,77.9 170.98,74.72 v167.49,71.23
  Bottom 0.305: v152.89,62.34 v154.79,64.25 | v167.49,71.23 v167.49,68.37
AMPENVELOPEOUT  (via drill 0.3)
  Top 0.305: IC16.2 148.76,58.53 148.25,58.02 R169.2 139.11,57.9 138.28,57.9 137.65,57.26 137.65,56.31 138.6,55.36 138.6,52.5 143.68,47.42 R198.1 143.81,30.91 145.58,30.91 147.81,28.69 155.11,28.69 156.38,27.42 158.92,27.42 160.19,28.69 168.13,28.69 169.13,29.69 J13.TIP_T@3 177.28,29.69 178.92,28.05 178.92,10.91 177.02,9 177.02,5.51 178.6,3.92 178.6,2.02 177.33,0.75 3.66,0.75 1.75,2.65 1.75,16.62 11.92,26.78 11.92,34.08 10.64,35.35 5.88,35.35 3.98,37.26 3.98,49.01 7.47,52.5 v8.11,52.5 | IC12.5 23.98,70.91 v24.62,70.28 | v21.44,66.79 21.44,62.98 23.03,61.39 23.03,59.8 22.39,59.17 v15.09,59.17 | v13.19,59.17 13.19,56.94 10.64,54.4 v8.11,54.4
  Bottom 0.305: v24.62,70.28 24.62,69.96 v21.44,66.79 | v15.09,59.17 v13.19,59.17 | v8.11,54.4 v8.11,52.5
CUTOFF1_MODENVINPUT
  Top 0.305: R135.1 114.53,20.11 109.71,20.11 | 109.71,20.11 108.75,19.16 R192.P$2 | 109.71,20.11 109.55,20.11 R136.P$1
CUTOFF2_MODENVINPUT
  Top 0.305: R152.1 129.58,15.86 R194.P$2
  Bottom 0.305: R194.P$2 132.25,22.73 R160.P$1
CUTOFF_ENVELOPE  (via drill 0.3)
  Top 0.305: v111.61,37.89 111.93,37.58 111.93,35.99 116.06,31.86 116.06,20.3 R144.2 116.25,20.11 IC11.1 | v124.95,46.91 R145.1
  Bottom 0.305: v111.61,37.89 115.42,41.7 121.77,41.7 124.95,44.88 v124.95,46.91
CUTOFF_ENVELOPE_2
  Top 0.305: R104.1 125.9,28.18 125.9,19.29 R143.2 125.45,18.84 IC11.7
CUTOFF_HP_IN  (via drill 0.3)
  Top 0.305: R58.2 135.61,83.3 IC5.7 131.93,83.3 131.77,83.14 131.77,79.96 132.09,79.65 132.09,75.84 v133.36,74.57 | v133.36,72.82 133.36,71.07 v136.06,68.37 | v136.06,64.56 136.06,60.59 133.04,57.58 v132.72,57.58 | R106.1 127.8,30.91 130.03,33.13 130.03,38.69 129.07,39.64 129.07,43.77 132.41,47.1 v132.41,49.01
  Bottom 0.305: v133.36,74.57 v133.36,72.82 | v136.06,68.37 v136.06,64.56 | v132.72,57.58 132.72,57.42 134.39,55.75 134.63,55.52 134.63,51.39 132.41,49.16 v132.41,49.01
CUTOFF_HP_IN_INV
  Top 0.305: R59.1 137.33,87.11 139.55,89.33 142.35,89.33 J16.TIP_T@3
CUTOFF_IN  (via drill 0.3)
  Top 0.305: R200.2 125.39,84.57 IC5.1 126.37,84.57 126.22,84.73 v126.22,85.2 | R120.1 131.14,54.09 132.57,55.52 132.88,55.52 138.12,60.75 138.12,62.02 138.76,62.66 138.76,64.41 137.8,65.36 133.36,65.36 v133.2,65.52 | v125.9,82.03 v125.9,77.11 | v132.09,72.5 132.09,69.48 v133.2,68.37
  Bottom 0.305: v126.22,85.2 126.22,82.34 v125.9,82.03 | v125.9,77.11 127.48,77.11 v132.09,72.5 | v133.2,68.37 v133.2,65.52
CUTOFF_IN_INV
  Top 0.305: R201.1 123.68,86.47 126.53,89.33 132.19,89.33 J8.TIP_T@3
CUTOFF_INPUT
  Top 0.254: IC9.P$19 125.93,57.87 127.17,56.63 R121.1 R120.2 R_BIAS_LP.2 127.99,50.97 R140.2 R146.2 R145.2
CUTOFF_KEYTRACK  (via drill 0.3)
  Top 0.305: IC15.1 117.83,80.76 R150.2 117.2,80.31 v115.42,78.53 | R109.1 127.8,32.18 129.39,33.77 129.39,38.37 127.8,39.96 127.8,42.02 123.99,45.83 123.99,46.78 | R146.1 124.95,49.01 123.99,48.05 123.99,46.78 | 123.99,46.78 123.36,46.78 122.41,47.74 v122.09,47.74 | v116.69,49.96 113.83,52.82 113.83,67.42 116.37,69.96 116.37,72.18 113.2,75.36 113.2,76.63 113.52,76.95 115.1,76.95 v115.42,76.63
  Bottom 0.305: v122.09,47.74 118.91,47.74 v116.69,49.96 | v115.42,78.53 v115.42,76.63
CUTOFF_KNOB
  Top 0.305: R140.1 120.82,50.28 118.91,48.37 117.33,48.37 113.2,52.5 113.2,60.75 112.25,61.71 111.1,61.71 R141.P$2
CUTOFF_KNOB_2  (via drill 0.3)
  Top 0.305: R105.1 127.8,29.64 129.39,28.05 131.3,28.05 132.57,29.32 132.57,31.54 130.98,33.13 130.98,38.53 129.71,39.8 129.71,43.29 133.2,46.78 133.2,49.32 130.98,51.55 130.98,52.82 136.85,58.69 v137.49,58.69 | v134.95,60.59 134.95,63.26 R165.P$2
  Bottom 0.305: v134.95,60.59 136.85,58.69 v137.49,58.69
CV_RACK
  Top 0.305: J3.SWITCH_T@3 3.98,93.77 1.12,90.92 1.12,56.31 3.66,53.77 10.01,53.77 12.87,50.91 12.87,43.29 14.14,42.02 J14.14 J14.13
D2_IN
  Top 0.305: R177.2 145.14,69.96 152.89,69.96 154.47,71.55 156.38,71.55 157.65,70.28 R181.P$2
D_IN  (via drill 0.3)
  Top 0.305: v148.76,48.05 151.62,48.05 152.57,49.01 152.57,51.86 155.74,55.04 155.74,58.21 v156.06,58.53 | v146.85,48.05 145.58,48.05 144,49.64 R172.2 | R185.P$2 164.67,61.07 158.6,61.07 v158.28,60.75
  Bottom 0.305: v148.76,48.05 v146.85,48.05 | v158.28,60.75 v156.06,58.53
EXP_FM_IN  (via drill 0.3)
  Top 0.305: v3.66,55.36 3.03,55.36 1.75,56.63 1.75,84.06 R17.1 | v2.07,53.77 2.07,43.29 v2.71,42.66
  Bottom 0.305: v2.07,53.77 v3.66,55.36 | v2.71,42.66 7.73,42.66 S1.3_T
FILTER_IN  (via drill 0.3)
  Top 0.305: R67.2 130.34,10.27 | 130.34,10.27 130.34,10.75 | 130.34,10.75 130.34,10.91 131.3,11.86 137.84,11.86 R64.2 | C67.+ 130.34,10.27 | v110.02,51.39 110.02,43.61 108.28,41.86 108.28,39.8 107.32,38.85 106.53,38.85 106.05,38.37 106.05,34.88 112.4,28.53 115.1,28.53 115.42,28.21 115.42,21.54 v115.26,21.38 | v117.17,21.38 119.55,21.38 120.02,20.91 120.02,15.99 v121.93,14.08 | v129.23,10.75 130.34,10.75
  Bottom 0.305: JP4.3 109.39,59.8 110.66,58.53 110.66,53.77 110.02,53.13 v110.02,51.39 | v115.26,21.38 v117.17,21.38 | v121.93,14.08 124.15,14.08 126.22,12.02 127.96,12.02 v129.23,10.75
FILTER_OUT  (via drill 0.3)
  Top 0.305: R39.1 136.22,24.88 134.15,26.94 v133.36,26.94 | v128.44,26.15 126.85,26.15 126.53,25.83 v126.53,24.24 | v125.1,24.24 117.48,24.24 116.69,25.04 v116.69,27.73 | v114.63,27.73 112.25,27.73 105.42,34.56 105.42,41.86 109.39,45.83 109.39,50.43 v108.59,51.23 | JP4.4 109.39,56.78 v107.96,55.36
  Bottom 0.305: v133.36,26.94 129.23,26.94 v128.44,26.15 | v126.53,24.24 v125.1,24.24 | v116.69,27.73 v114.63,27.73 | v107.96,55.36 107.96,51.86 v108.59,51.23
GATE_IN  (via drill 0.3)
  Top 0.305: IC17.4 145.9,83.49 C59.1 147.17,83.93 147.49,84.25 147.49,86.47 148.12,87.11 148.44,87.11 | IC16.4 146.22,61.9 C56.1 146.66,65.33 v148.76,67.42 | S2.1 3.53,75.99 R199.1 | S2.1 5.25,74.06 D6.CATHODE | S2.1 5.25,76.31 3.98,77.58 3.98,79.8 S2.2 6.2,82.03 v6.2,84.57 | v151.62,72.5 151.62,73.77 150.66,74.72 150.66,86.47 150.03,87.11 148.44,87.11 | v6.2,86.79 4.93,88.06 4.93,90.28 6.2,91.55 9.69,91.55 10.64,90.6 12.23,90.6 14.46,92.82 17.95,92.82 18.58,93.46 18.58,94.41 20.49,96.31 56.05,96.31 57,95.36 60.18,95.36 61.13,96.31 83.99,96.31 84.94,95.36 88.12,95.36 89.07,96.31 129.71,96.31 130.66,95.36 133.84,95.36 135.11,96.63 139.55,96.63 140.82,95.36 144,95.36 145.27,96.63 147.49,96.63 148.44,95.68 148.44,87.11
  Bottom 0.305: v148.76,67.42 151.62,70.28 v151.62,72.5 | v6.2,84.57 v6.2,86.79
GATE_RACK  (via drill 0.3)
  Top 0.305: J14.15 J14.16 15.09,39.48 11.92,42.66 11.92,50.28 v9.69,52.5 | v9.69,55.36 9.69,55.67 11.28,57.26 11.28,65.63 J2.SWITCH_T@3
  Bottom 0.305: v9.69,52.5 v9.69,55.36
GATELED  (via drill 0.3)
  Top 0.305: IC12.6 23.72,72.82 | 23.72,72.82 IC12.7 | S2.LEDPOS 7.79,75.36 8.42,74.72 11.92,74.72 12.87,73.77 13.5,73.77 14.46,74.72 16.36,74.72 v17.31,75.68 | v22.71,72.82 23.72,72.82
  Bottom 0.305: v17.31,75.68 19.85,75.68 v22.71,72.82
GND  (via drill 0.3)
  Top 0.051: IC9.P$7 121.45,61.78
  Top 0.076: IC8.P$7 118.6,38.22
  Top 0.203: 121.45,61.78 v121.45,62.34 | 118.6,38.22 v118.6,38.85
  Top 0.508: IC17.7 v142.09,82.98 | C54.1 v149.71,86.15 | C58.1 146.38,86.31 v146.22,86.47 | C60.1 v140.82,86.47 | IC17.14 v147.17,74.72 | R175.2 145.77,71.42 v145.58,70.6 145.39,71.42 R176.1 | R166.2 v148.76,70.6 | C61.2 v142.41,70.44 | IC16.7 v142.41,61.55 | C55.1 v141.14,64.56 | C53.1 v150.03,64.56 | IC16.14 v147.49,56.31 | C45.1 v113.2,78.85 | C42.2 v20.96,69.8 | C50.1 v21.76,68.69 | IC13.3 16.36,64.25 | 16.36,64.25 v15.41,64.25 | C43.2 21.38,61.01 v21.76,61.07 | IC13.5 v25.41,62.98 | C12.2 v26.2,42.02 | 27.47,54.4 C14.2 v27.47,55.36 | R49.1 v70.97,58.53 | C18.1 v73.51,61.71 | C17.2 v76.05,58.05 | IC4.12 v73.51,54.72 | IC18.3 v59.54,46.15 | C8.1 v60.81,42.66 | IC18.5 v60.81,54.4 | IC3.12 v46.84,54.4 | C10.2 v48.9,58.53 | R20.1 v43.03,59.17 | C9.1 39.92,48.75 v39.86,48.53 | R196.1 145.46,25.7 v145.58,25.83 | R197.2 v146.22,27.73 | R159.2 v150.98,24.88 | C52.1 v151.62,19.8 | R151.2 v150.98,15.35 | R195.2 144.5,14.91 v144.47,14.56 | C46.2 v140.19,19.8 | C47.2 140.22,20.78 v140.19,20.43 | IC1.5 v18.9,24.24 | C1.2 v17,24.56 | C2.1 v24.62,25.83 | C3.1 v40.17,66.63 | C6.1 v44.3,62.34 | C4.1 v56.37,57.26 | Q1.E 92.23,74.87 v92.08,74.72 | IC2.4 v92.88,71.55 | R203.1 v99.23,75.04 | C66.1 v100.82,78.22 | C5.2 98.47,68.57 v98.59,68.69 | IC2.10 v91.61,62.66 | IC2.8 v89.07,62.5 | R205.1 v88.12,59.17 | C65.1 v98.91,55.67 | R199.2 2.87,72.98 v3.03,72.82 | R2.2 9.63,83.87 v9.53,83.3 | IC10.5 v11.92,87.42 | IC10.3 v17.15,86.15 | C38.1 v16.36,81.71 | C49.1 v16.36,79.8 | U1.1 15.71,77.28 v15.72,76.95 | C39.1 v16.36,89.33 | IC6.8 v88.43,44.88 | IC6.6 v90.97,44.88 | C25.1 91.45,49.96 v91.45,50.28 | C32.2 102.31,40.53 v102.4,40.43 | R38.2 v45.89,42.81 | C21.1 v70.34,61.71 | R31.2 v72.56,42.97 | 117.64,60.75 C30.1 117.52,61.26 v117.01,61.39 117.52,61.52 C31.1
  Top 0.508: C37.2 129.52,63.64 v129.39,63.77 | C36.2 v125.9,53.13 | R121.2 v130.34,56.63 | C57.1 v142.73,49.96 | R171.1 v145.27,49.96 | R170.2 v146.54,49.96 | R162.2 v150.35,49.96 | R111.2 v128.12,33.45 | C20.- v26.2,51.55 | C11.+ v25.09,60.75 | C48.1 22.58,75.8 v22.71,75.68 | Q2.E 94.61,59.34 v94.78,59.32 | IC2.7 v89.07,71.71 | IC2.6 v90.34,71.71 | C44.2 16.36,64.25 | IC14.1 149.81,22.81 v150.5,22.81 | C13.1 v130.98,86.47 | IC5.3 v129.55,82.03 | C22.2 v130.34,78.85 | IC5.5 v134.79,80.76 | C51.2 v107.8,86.15 | C79.1 96.24,33.13 v94.78,33.13 | C78.1 89.51,31.86 v90.66,31.86 | C76.1 161.01,17.57 v160.19,17.57 | IC19.3 v165.9,18.84 | C77.1 168.95,18.53 v168.13,18.53 | IC19.5 v167.17,20.75 | C24.2 v91.29,22.34 | C28.1 v93.51,14.72 | C41.1 v121.14,22.02 | C40.2 v120.5,14.4 | C80.1 82.85,50.78 v83.04,50.59 | C81.1 81.32,59.36 v81.45,59.48 | D8.ANODE v95.58,79.01 | D9.ANODE 92.07,54.1 v92.4,53.77
  Bottom 0.508: v142.09,82.98 142.09,83.3 | v147.17,74.72 147.17,74.41 | v145.58,70.6 145.58,70.91 | v142.41,61.55 142.41,61.71 | v141.14,64.56 141.14,64.88 | v147.49,56.31 147.49,56.63 | v15.41,64.25 17.31,64.25 | v21.76,61.07 21.92,61.07 | v70.97,58.53 70.97,58.85 | v73.51,61.71 73.51,61.87 | v76.05,58.05 76.05,57.9 | v46.84,54.4 46.84,55.04 | v48.9,58.53 48.75,58.53 | v43.03,59.17 43.03,59.48 | v150.98,24.88 151.3,24.88 | v150.98,15.35 150.82,15.35 | v144.47,14.56 144.31,14.4 | v140.19,19.8 139.87,19.8 | v24.62,25.83 24.93,25.83 | v40.17,66.63 40.17,66.79 | v92.08,74.72 91.93,74.72 | v92.88,71.55 92.88,71.87 | v99.23,75.04 99.39,75.04 | v98.59,68.69 98.59,69.01 | v91.61,62.66 91.61,62.34 | v89.07,62.5 89.07,62.18 | v98.91,55.67 98.59,55.67 | v11.92,87.42 11.6,87.42 | v17.15,86.15 17,86.15 | v16.36,89.33 16.04,89.33 | v91.45,50.28 91.61,50.28 | v102.4,40.43 102.72,40.43 | v45.89,42.81 45.89,42.66 | v70.34,61.71 68.43,61.71 | v72.56,42.97 72.56,42.66 | v129.39,63.77 129.39,63.93 | v125.9,53.13 125.9,52.97 | v130.34,56.63 130.5,56.63 | v117.01,61.39 117.64,61.39 | v25.09,60.75 24.77,60.59 | v22.71,75.68 22.39,75.68 | v94.78,59.32 94.94,59.32 | v89.07,71.71 89.07,72.03 | v90.34,71.71 90.34,71.87 | v130.98,86.47 130.34,86.47 | v130.34,78.85 130.66,78.85 | v134.79,80.76 135.11,80.76 | v107.8,86.15 107.48,86.15 | v94.78,33.13 94.78,32.81 | v90.66,31.86 90.97,31.86 | v165.9,18.84 165.9,19.16 | v168.13,18.53 168.13,18.84 | v167.17,20.75 167.81,20.75 | v91.29,22.34 90.66,22.34 | v93.51,14.72 93.83,14.72 | v121.14,22.02 120.82,22.02 | v120.5,14.4 121.14,14.4 | v83.04,50.59 83.04,50.28 | v81.45,59.48 81.77,59.48 | v95.58,79.01 96.05,79.01 | v92.4,53.77 92.72,53.77
  pour Bottom: 193.91,106.22 184.48,-4.27 182.03,-4.65 -3.01,-4.65 -7.86,104.16
  pour Top: 119.14,38.91 119.14,38.81 118.6,38.27
HARDSYNC_2_IN  (via drill 0.3)
  Top 0.305: C15.2 74.88,40.34 v75.42,39.8 | v76.53,35.83 72.4,35.83 70.97,34.4 67.8,34.4 62.24,28.85 60.81,28.85 60.18,28.21 v58.75,28.21 | v57.64,24.24 57.64,22.97 56.37,21.7 56.37,13.13 57,12.49 61.76,12.49 63.29,10.97 S3.3_T
  Bottom 0.305: v75.42,39.8 75.42,36.94 v76.53,35.83 | v58.75,28.21 57.64,27.1 v57.64,24.24
HARDSYNC_IN  (via drill 0.3)
  Top 0.305: v61.76,86.47 C23.2
  Bottom 0.305: J4.TIP_T@3 61.13,87.11 v61.76,86.47
HIGHPASS_IN  (via drill 0.3)
  Top 0.305: C26.1 113.52,36.62 113.2,36.94 113.2,39.16 114.47,40.43 114.47,41.39 v116.37,43.29 | v113.2,45.2 112.56,45.2 110.98,46.78 110.98,50.28 112.25,51.55 112.25,54.09 110.66,55.67 110.66,58.85 JP4.5
  Bottom 0.305: v116.37,43.29 114.47,45.2 v113.2,45.2
HIGHPASS_OUT  (via drill 0.3)
  Top 0.305: R107.1 119.23,26.79 C33.- v117.33,26.46 | JP4.2 106.85,51.55 108.75,49.64 108.75,46.47 104.62,42.34 104.62,34.4 112.56,26.46 v114.47,26.46
  Bottom 0.305: v114.47,26.46 v117.33,26.46
HP_FILTER_CUTOFF_IN
  Top 0.254: IC8.P$19 123.97,35.69 124.95,34.72 R_BIAS_HP.1 R111.1 124.63,33.45 124.18,33 R109.2 R106.2 R105.2 R104.2
HP_RESONANCE_IN  (via drill 0.3)
  Top 0.305: v134.79,31.86 134.79,30.59 131.3,27.1 v126.85,27.1 | v120.5,28.05 R108.2 | v134.79,38.53 R161.P$2
  Bottom 0.305: v134.79,38.53 v134.79,31.86 | v126.85,27.1 121.45,27.1 v120.5,28.05
INVERTED_CVSUM
  Top 0.305: R70.2 18.77,83.49 IC10.1 19.03,83.23 R71.1
INVERTED_CVSUM1
  Top 0.305: IC19.1 163.36,15.03 | 163.36,15.03 163.36,13.26 R80.2 | R85.1 163.17,14.84 163.36,15.03
KEYTRACK_INPUT
  Top 0.305: R155.1 R16.2 121.45,88.06 120.5,89.01 115.74,89.01 114.51,87.78 R158.P$1
LINEAR_FM_IN  (via drill 0.3)
  Top 0.305: v52.24,61.39 52.11,61.52 C7.2 v45.57,62.66 | v57,61.39 57,63.29 57.64,63.93 71.29,63.93 72.24,62.98 C19.2 | v28.74,59.8 28.74,41.7 24.62,37.58 12.55,37.58 12.23,37.26 v11.92,37.26 | v30.65,61.39 33.51,61.39 v37,64.88
  Bottom 0.305: v52.24,61.39 v57,61.39 | v28.74,59.8 29.06,59.8 v30.65,61.39 | v37,64.88 43.35,64.88 v45.57,62.66 | S1.1_T 7.85,33.19 v11.92,37.26
LOWPASS_IN  (via drill 0.3)
  Top 0.305: R96.2 119.42,66.91 v118.91,67.42 | JP4.1 106.85,61.71 108.12,62.98 108.12,65.83 109.71,67.42 v112.25,67.42
  Bottom 0.305: v118.91,67.42 v112.25,67.42
LOWPASS_OUT  (via drill 0.3)
  Top 0.305: R90.1 119.05,53.96 C29.- 117.34,55.67 v116.06,55.67 | v112.25,55.67 111.93,55.99 JP4.6
  Bottom 0.305: v116.06,55.67 v112.25,55.67
MAIN_CV
  Top 0.305: J3.TIP_T@3 13.64,89.27 R14.1
MAIN_CV_SUMLINE  (via drill 0.3)
  Top 0.305: R69.2 R68.2 | R70.1 30.14,85.01 30.96,85.84 33.63,85.84 R68.2 | R70.1 21,84.88 IC10.2 v17,84.88 | R14.2 19.85,91.23 21.12,89.96 R70.1 | R17.2 14.77,85.52 v15.41,84.88 | R68.2 33.12,86.34 R57.2
  Bottom 0.305: v15.41,84.88 v17,84.88
MAIN_CV_SUMLINE1
  Top 0.305: R83.2 158.28,15.03 159.55,16.3 161.78,16.3 162.41,16.94 162.41,18.84 162.73,19.16 164.32,19.16 164.63,18.84 IC19.2 164.63,13.26 R80.1
MASTER_COARSEPITCH
  Top 0.305: R69.1 37.44,88.19 38.27,89.01 41.41,89.01 43.35,87.07 R42.P$2
MASTER_FINEPITCH
  Top 0.305: R68.1 33.95,88.06 32.87,88.06 31.92,89.01 26.84,89.01 25.57,87.74 R26.P$2
MIXER_POSTSUM
  Top 0.305: IC1.7 21.44,20.24 R12.2 R13.1
MIXER_SUMLINE  (via drill 0.3)
  Top 0.305: R77.2 R62.2 55.6,26.15 43.03,26.15 42.59,26.59 R44.2 R10.2 39.86,26.46 v30.96,26.46 | 56.37,74.6 R61.2 R25.2 34.33,74.6 32.24,72.5 32.24,69.01 30.65,67.42 30.65,63.61 29.7,62.66 29.7,36.31 25.25,31.86 v25.25,27.1 | 56.37,74.6 71.29,74.6 R88.2 | R75.2 56.37,74.6 | R12.1 20.17,20.24 IC1.6 20.17,24.88 20.8,25.51 v22.39,25.51
  Bottom 0.305: v22.39,25.51 23.34,26.46 25.25,26.46 | 25.25,26.46 v30.96,26.46 | v25.25,27.1 25.25,26.46
MODENVOUT  (via drill 0.3)
  Top 0.305: IC17.2 148.44,80.12 147.93,79.61 R173.2 134.92,79.61 v133.04,77.74 | v142.09,33.13 138.28,33.13 130.34,25.19 130.34,22.02 131.61,20.75 132.57,20.75 R194.P$3 133.2,16.94 131.61,16.94 128.12,13.45 128.12,9.64 125.9,7.41 J15.SWITCH_T@3 114.47,7.41 v112.56,9.32 | J11.TIP_T@3 148.07,29.69 v144.63,33.13 | v111.29,11.22 111.29,16.94 | 111.29,16.94 R192.P$3 | v130.34,76.79 127.8,74.25 126.85,74.25 122.88,78.22 117.96,78.22 117.8,78.38 v117.8,78.85 | v113.83,73.3 113.52,73.61 107.8,73.61 106.69,74.72 106.69,75.68 v105.58,76.79 105.42,76.79 102.72,74.09 102.72,50.59 101.77,49.64 101.77,42.66 103.04,41.39 103.04,38.21 98.75,33.92 v98.75,29.32 | v101.29,26.78 101.29,21.23 105.58,16.94 111.29,16.94
  Bottom 0.305: v144.63,33.13 v142.09,33.13 | v112.56,9.32 111.29,10.59 v111.29,11.22 | v133.04,77.74 131.3,77.74 v130.34,76.79 | R193.P$3 103.99,78.38 v105.58,76.79 | v113.83,73.3 113.99,73.3 117.01,76.31 117.01,78.06 v117.8,78.85 | v98.75,29.32 v101.29,26.78
N$1
  Top 0.305: R163.1 R162.1 | R163.1 149.08,52.5 | IC16.15 148.76,52.63 R163.1
N$2
  Top 0.305: IC16.12 144.95,52.63 R171.2 R172.1
N$3
  Top 0.305: IC16.13 146.22,52.63 R170.1 R164.1
N$4
  Top 0.305: IC16.1 C53.2
N$5
  Top 0.305: IC14.8 140.25,17.51 C46.1
N$6
  Top 0.305: IC16.5 144.95,62.15 C56.2
N$7
  Top 0.508: J14.10 J14.9 21.03,47.1 D2.1
N$8
  Top 0.508: J14.2 J14.1 22.49,57.26 D3.2
N$9
  Top 0.305: IC16.6 R168.1
N$10
  Top 0.305: IC16.8 C55.2
N$11
  Top 0.305: IC16.10 142.41,55.99 141.9,56.5 R169.1
N$12
  Top 0.305: IC14.4 IC14.3 147.17,24.69 R196.2
N$13
  Top 0.305: R159.1 148.44,24.69 IC14.2 148.44,21.38 149.08,20.75 152.25,20.75 154.35,18.65 R81.1
N$14
  Top 0.305: IC14.13 148.44,15.54 R151.1 148.63,14.84 149.39,14.08 153.2,14.08 154.16,15.03 R83.1
N$15
  Top 0.305: R195.1 145.9,15.48 IC14.11 IC14.12
N$16
  Top 0.305: R6.2 C3.2
N$17